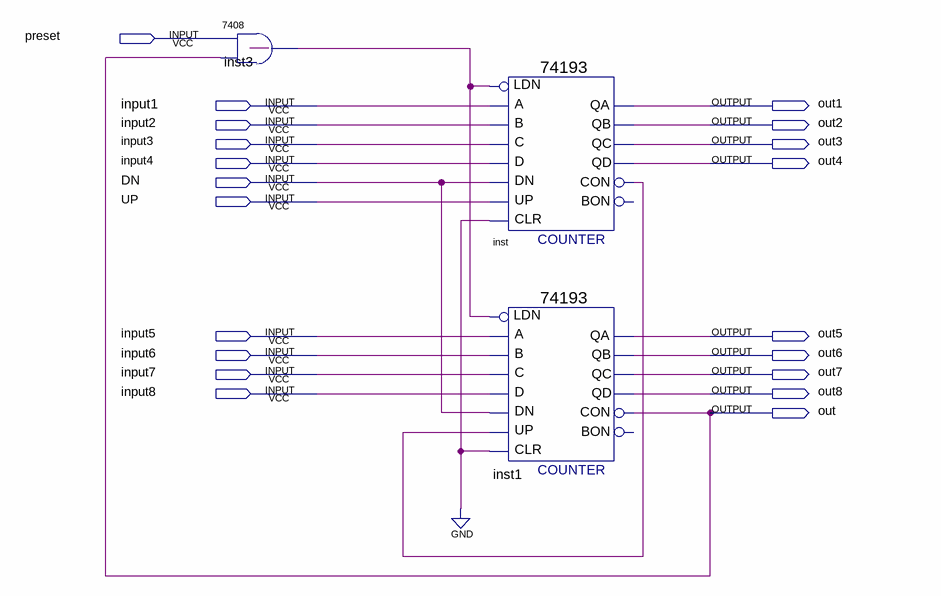
[diagram p0: schematic sheet]
// Quartus schematic Divider.bdf as structural Verilog: 3 symbols, 20 pins
module Divider (
  input  preset,
  input  input1,
  input  input2,
  input  input3,
  input  input4,
  input  DN,
  input  UP,
  input  input5,
  input  input6,
  input  input7,
  input  input8,
  output out1,
  output out2,
  output out3,
  output out4,
  output out5,
  output out6,
  output out7,
  output out8,
  output out
);

  wire inst3_1, inst_con;

  \7408  inst3 (.\3 (out), .\2 (preset), .\1 (inst3_1));
  \74193  inst (
    .D(input4), .C(input3), .B(input2), .A(input1), .CLR(1'b0), .UP(UP), .DN(DN), .LDN(inst3_1), .QB(out2),
    .QA(out1), .CON(inst_con), .QD(out4), .QC(out3));  // open: BON
  \74193  inst1 (
    .D(input8), .C(input7), .B(input6), .A(input5), .CLR(1'b0), .UP(inst_con), .DN(DN), .LDN(inst3_1),
    .QB(out6), .QA(out5), .CON(out), .QD(out8), .QC(out7));  // open: BON
endmodule
